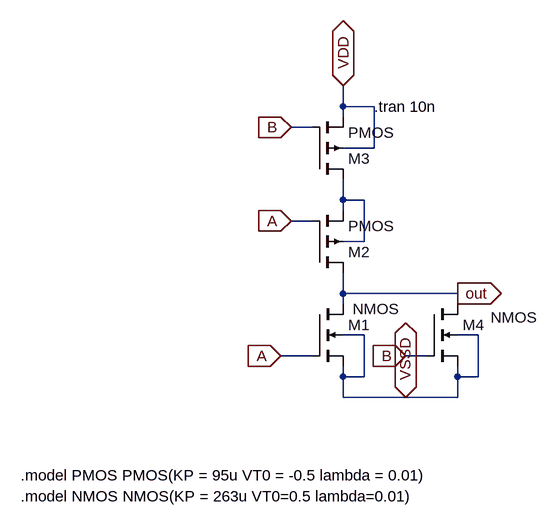
[diagram p0: schematic my_nor_1GHz.asc]
my_nor_1GHz.asc, the LTspice schematic file:
Version 4
SHEET 1 1208 680
WIRE 448 -128 448 -160
WIRE 496 -128 448 -128
WIRE 448 -112 448 -128
WIRE 400 -96 368 -96
WIRE 496 -64 496 -128
WIRE 496 -64 448 -64
WIRE 448 16 448 -16
WIRE 480 16 448 16
WIRE 448 32 448 16
WIRE 400 48 368 48
WIRE 480 80 480 16
WIRE 480 80 448 80
WIRE 448 160 448 128
WIRE 624 160 448 160
WIRE 448 176 448 160
WIRE 624 176 624 160
WIRE 480 224 448 224
WIRE 656 224 624 224
WIRE 400 256 352 256
WIRE 576 256 544 256
WIRE 448 288 448 272
WIRE 480 288 480 224
WIRE 480 288 448 288
WIRE 624 288 624 272
WIRE 656 288 656 224
WIRE 656 288 624 288
WIRE 448 320 448 288
WIRE 544 320 448 320
WIRE 624 320 624 288
WIRE 624 320 544 320
FLAG 368 48 A
IOPIN 368 48 In
FLAG 352 256 A
IOPIN 352 256 In
FLAG 544 256 B
IOPIN 544 256 In
FLAG 368 -96 B
IOPIN 368 -96 In
FLAG 448 -160 VDD
IOPIN 448 -160 BiDir
FLAG 544 320 VSSD
IOPIN 544 320 BiDir
FLAG 624 160 out
IOPIN 624 160 Out
SYMBOL nmos4 400 176 R0
WINDOW 3 63 8 Left 2
SYMATTR InstName M1
SYMATTR Value2 l=180n w=1.5u
SYMBOL pmos4 400 128 M180
SYMATTR InstName M2
SYMATTR Value2 l=180n w=9.3u
SYMBOL pmos4 400 -16 M180
SYMATTR InstName M3
SYMATTR Value2 l=180n w=9.3u
SYMBOL nmos4 576 176 R0
WINDOW 3 99 21 Left 2
SYMATTR InstName M4
SYMATTR Value2 l=180n w=1.5u
TEXT 496 -128 Left 2 !.tran 10n
TEXT -48 440 Left 2 !.model PMOS PMOS(KP = 95u VT0 = -0.5 lambda = 0.01)
TEXT -48 472 Left 2 !.model NMOS NMOS(KP = 263u VT0=0.5 lambda=0.01)

The netlist it stands for:
* my_nor_1GHz.asc
M1 out A VSSD VSSD NMOS l=180n w=1.5u
M2 out A N001 N001 PMOS l=180n w=9.3u
M3 N001 B VDD VDD PMOS l=180n w=9.3u
M4 out B VSSD VSSD NMOS l=180n w=1.5u
.model NMOS NMOS
.model PMOS PMOS
.lib standard.mos
.tran 10n
.model PMOS PMOS(KP = 95u VT0 = -0.5 lambda = 0.01)
.model NMOS NMOS(KP = 263u VT0=0.5 lambda=0.01)
.backanno
.end